# Altium schematic sheet total.SchDoc
size A3
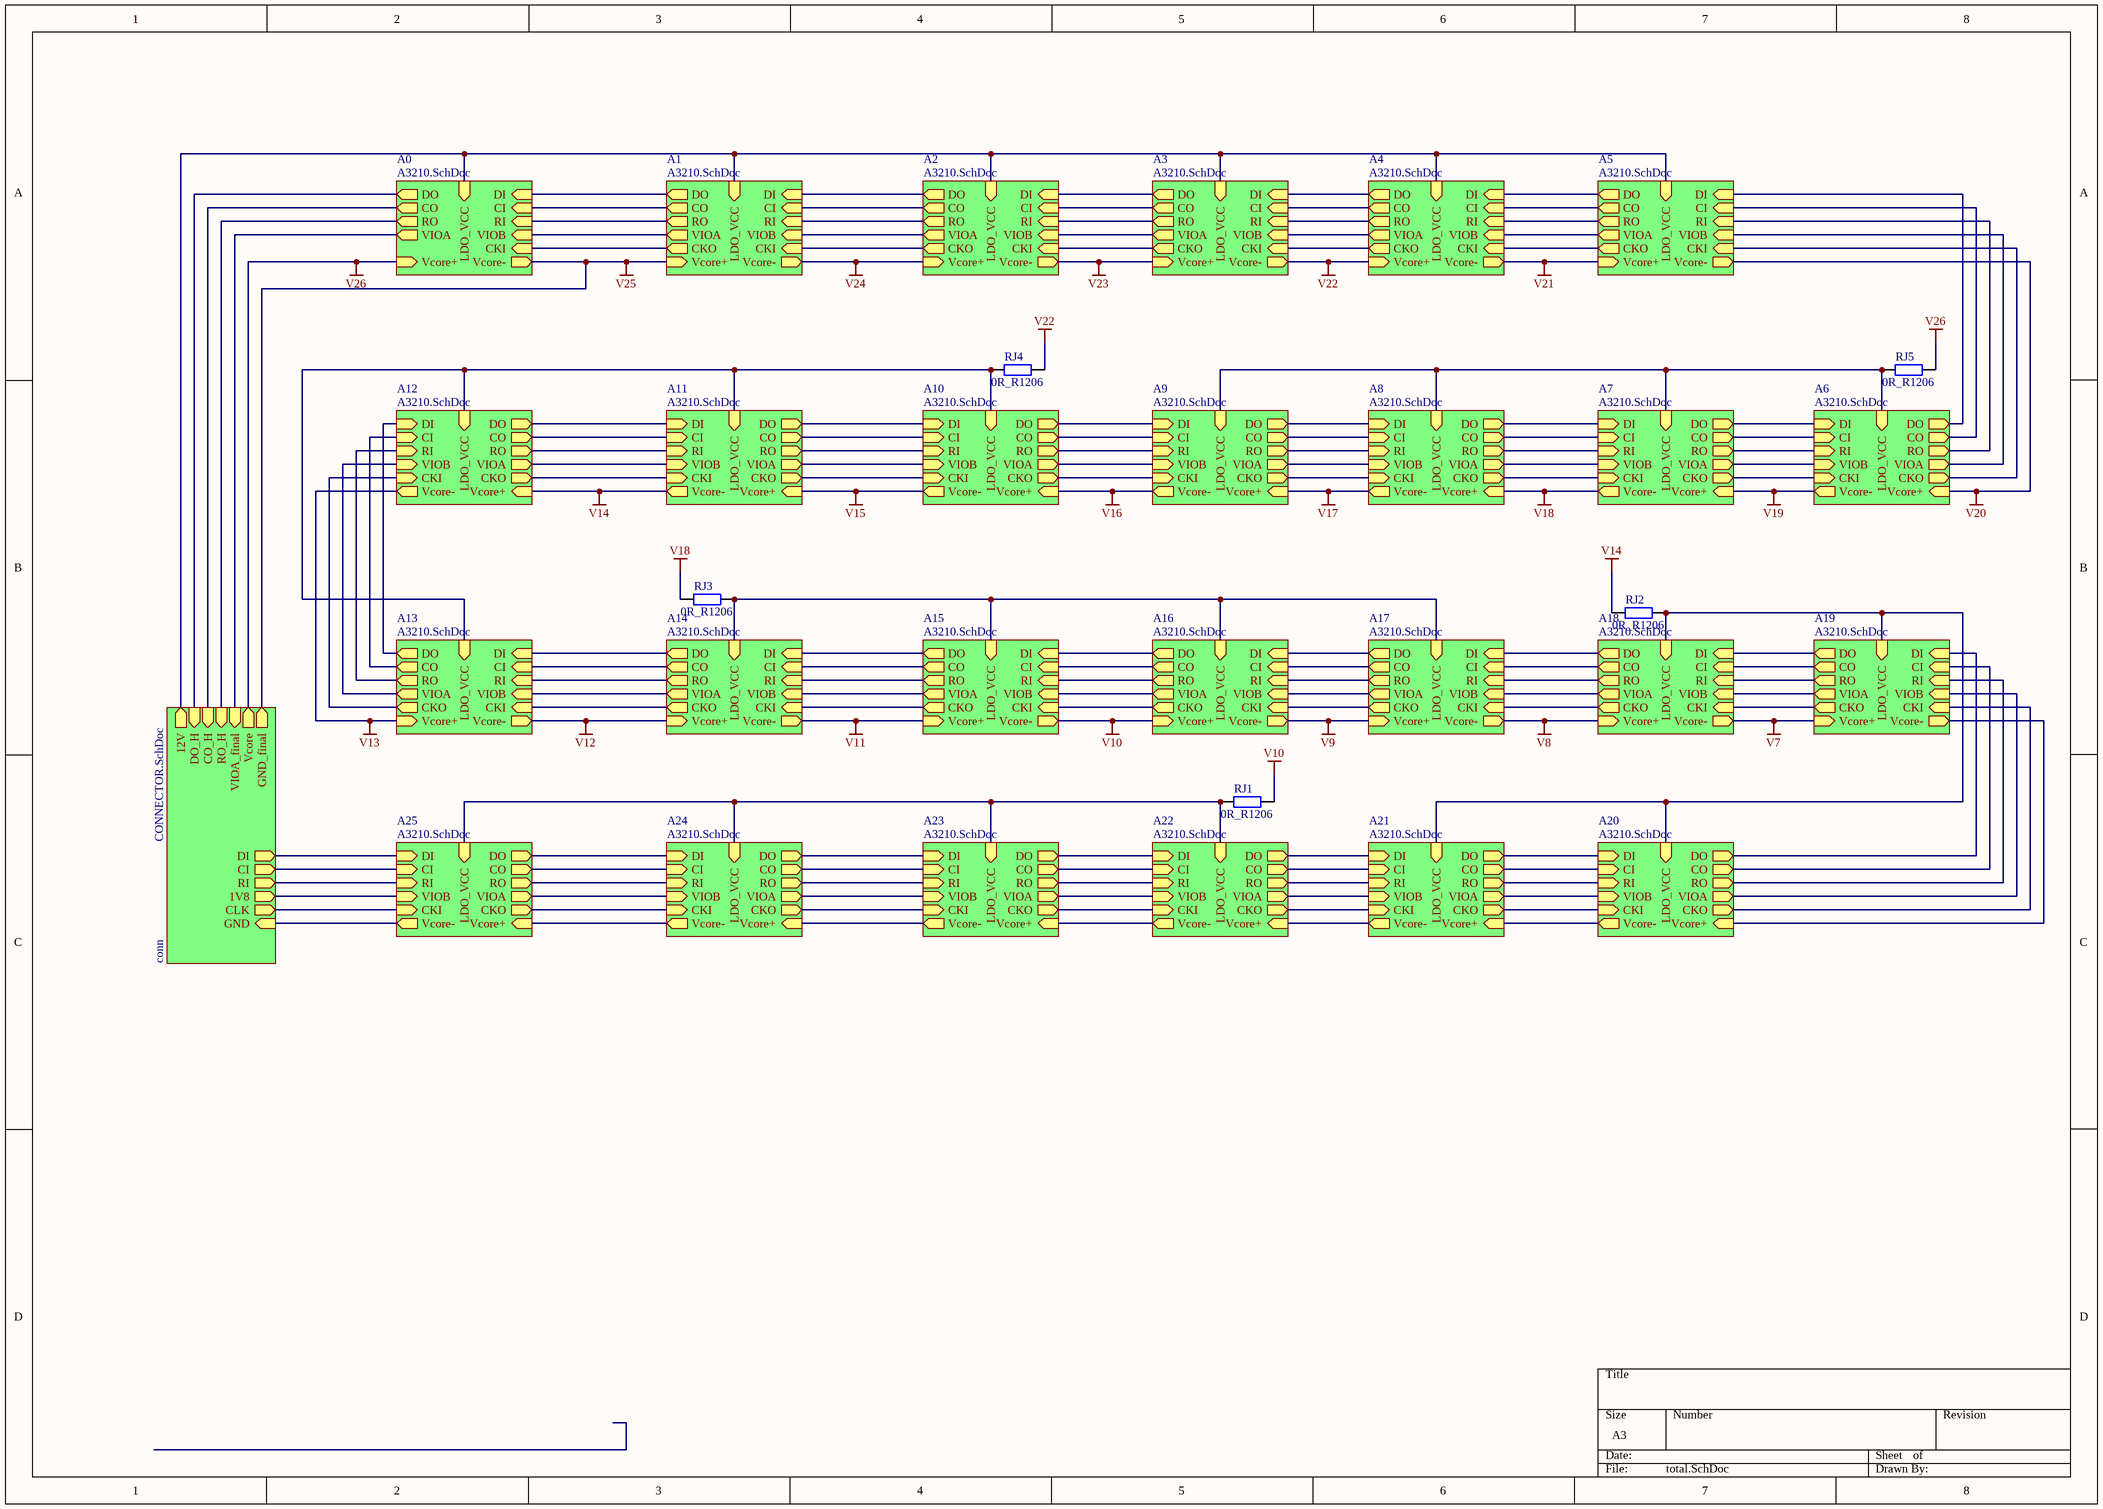
[diagram p0: total.SchDoc]

## Parts
RJ1  value 0R_R1206  [R1206]  (hidden comment: Res2)
RJ2  value 0R_R1206  [R1206]  (hidden comment: Res2)
RJ3  value 0R_R1206  [R1206]  (hidden comment: Res2)
RJ4  value 0R_R1206  [R1206]  (hidden comment: Res2)
RJ5  value 0R_R1206  [R1206]  (hidden comment: Res2)

## Sub-sheets
A0 = A3210.SchDoc: DI (in), CI (in), RI (in), DO (out), RO (out), CO (out), VIOB (in), VIOA (out), LDO_VCC (in), Vcore+ (in), Vcore- (out), CKI (in)
A1 = A3210.SchDoc: DI (in), CI (in), RI (in), DO (out), RO (out), CO (out), VIOB (in), VIOA (out), LDO_VCC (in), Vcore+ (in), Vcore- (out), CKI (in), CKO (out)
A2 = A3210.SchDoc: DI (in), CI (in), RI (in), DO (out), RO (out), CO (out), VIOB (in), VIOA (out), LDO_VCC (in), Vcore+ (in), Vcore- (out), CKI (in), CKO (out)
A3 = A3210.SchDoc: DI (in), CI (in), RI (in), DO (out), RO (out), CO (out), VIOB (in), VIOA (out), LDO_VCC (in), Vcore+ (in), Vcore- (out), CKI (in), CKO (out)
A4 = A3210.SchDoc: DI (in), CI (in), RI (in), DO (out), RO (out), CO (out), VIOB (in), VIOA (out), LDO_VCC (in), Vcore+ (in), Vcore- (out), CKI (in), CKO (out)
A5 = A3210.SchDoc: DI (in), CI (in), RI (in), DO (out), RO (out), CO (out), VIOB (in), VIOA (out), LDO_VCC (in), Vcore+ (in), Vcore- (out), CKI (in), CKO (out)
A6 = A3210.SchDoc: DI (in), CI (in), RI (in), DO (out), RO (out), CO (out), VIOB (in), VIOA (out), LDO_VCC (in), Vcore+ (in), Vcore- (out), CKI (in), CKO (out)
A7 = A3210.SchDoc: DI (in), CI (in), RI (in), DO (out), RO (out), CO (out), VIOB (in), VIOA (out), LDO_VCC (in), Vcore+ (in), Vcore- (out), CKI (in), CKO (out)
A8 = A3210.SchDoc: DI (in), CI (in), RI (in), DO (out), RO (out), CO (out), VIOB (in), VIOA (out), LDO_VCC (in), Vcore+ (in), Vcore- (out), CKI (in), CKO (out)
A9 = A3210.SchDoc: DI (in), CI (in), RI (in), DO (out), RO (out), CO (out), VIOB (in), VIOA (out), LDO_VCC (in), Vcore+ (in), Vcore- (out), CKI (in), CKO (out)
A10 = A3210.SchDoc: DI (in), CI (in), RI (in), DO (out), RO (out), CO (out), VIOB (in), VIOA (out), LDO_VCC (in), Vcore+ (in), Vcore- (out), CKI (in), CKO (out)
A11 = A3210.SchDoc: DI (in), CI (in), RI (in), DO (out), RO (out), CO (out), VIOB (in), VIOA (out), LDO_VCC (in), Vcore+ (in), Vcore- (out), CKI (in), CKO (out)
A12 = A3210.SchDoc: DI (in), CI (in), RI (in), DO (out), RO (out), CO (out), VIOB (in), VIOA (out), LDO_VCC (in), Vcore+ (in), Vcore- (out), CKI (in), CKO (out)
A13 = A3210.SchDoc: DI (in), CI (in), RI (in), DO (out), RO (out), CO (out), VIOB (in), VIOA (out), LDO_VCC (in), Vcore+ (in), Vcore- (out), CKI (in), CKO (out)
A14 = A3210.SchDoc: DI (in), CI (in), RI (in), DO (out), RO (out), CO (out), VIOB (in), VIOA (out), LDO_VCC (in), Vcore+ (in), Vcore- (out), CKI (in), CKO (out)
A15 = A3210.SchDoc: DI (in), CI (in), RI (in), DO (out), RO (out), CO (out), VIOB (in), VIOA (out), LDO_VCC (in), Vcore+ (in), Vcore- (out), CKI (in), CKO (out)
A16 = A3210.SchDoc: DI (in), CI (in), RI (in), DO (out), RO (out), CO (out), VIOB (in), VIOA (out), LDO_VCC (in), Vcore+ (in), Vcore- (out), CKI (in), CKO (out)
A17 = A3210.SchDoc: DI (in), CI (in), RI (in), DO (out), RO (out), CO (out), VIOB (in), VIOA (out), LDO_VCC (in), Vcore+ (in), Vcore- (out), CKI (in), CKO (out)
A18 = A3210.SchDoc: DI (in), CI (in), RI (in), DO (out), RO (out), CO (out), VIOB (in), VIOA (out), LDO_VCC (in), Vcore+ (in), Vcore- (out), CKI (in), CKO (out)
A19 = A3210.SchDoc: DI (in), CI (in), RI (in), DO (out), RO (out), CO (out), VIOB (in), VIOA (out), LDO_VCC (in), Vcore+ (in), Vcore- (out), CKI (in), CKO (out)
A20 = A3210.SchDoc: DI (in), CI (in), RI (in), DO (out), RO (out), CO (out), VIOB (in), VIOA (out), LDO_VCC (in), Vcore+ (in), Vcore- (out), CKI (in), CKO (out)
A21 = A3210.SchDoc: DI (in), CI (in), RI (in), DO (out), RO (out), CO (out), VIOB (in), VIOA (out), LDO_VCC (in), Vcore+ (in), Vcore- (out), CKI (in), CKO (out)
A22 = A3210.SchDoc: DI (in), CI (in), RI (in), DO (out), RO (out), CO (out), VIOB (in), VIOA (out), LDO_VCC (in), Vcore+ (in), Vcore- (out), CKI (in), CKO (out)
A23 = A3210.SchDoc: DI (in), CI (in), RI (in), DO (out), RO (out), CO (out), VIOB (in), VIOA (out), LDO_VCC (in), Vcore+ (in), Vcore- (out), CKI (in), CKO (out)
A24 = A3210.SchDoc: DI (in), CI (in), RI (in), DO (out), RO (out), CO (out), VIOB (in), VIOA (out), LDO_VCC (in), Vcore+ (in), Vcore- (out), CKI (in), CKO (out)
A25 = A3210.SchDoc: DI (in), CI (in), RI (in), DO (out), RO (out), CO (out), VIOB (in), VIOA (out), LDO_VCC (in), Vcore+ (in), Vcore- (out), CKI (in), CKO (out)
conn = CONNECTOR.SchDoc: RI (out), CI (out), DI (out), RO_H (in), CO_H (in), DO_H (in), 12V (out), 1V8 (out), GND (in), Vcore (out), CLK (out), VIOA_final (in), GND_final (out)

## Nets
V7: sheet A18/Vcore-, sheet A19/Vcore+
V8: sheet A18/Vcore+, sheet A17/Vcore-
V9: sheet A17/Vcore+, sheet A16/Vcore-
V10: RJ1.1 ; sheet A16/Vcore+, sheet A15/Vcore-
V11: sheet A15/Vcore+, sheet A14/Vcore-
V12: sheet A14/Vcore+, sheet A13/Vcore-
V13: sheet A13/Vcore+, sheet A12/Vcore-
V14: RJ2.2 ; sheet A11/Vcore-, sheet A12/Vcore+
V15: sheet A11/Vcore+, sheet A10/Vcore-
V16: sheet A10/Vcore+, sheet A9/Vcore-
V17: sheet A9/Vcore+, sheet A8/Vcore-
V18: RJ3.2 ; sheet A8/Vcore+, sheet A7/Vcore-
V19: sheet A7/Vcore+, sheet A6/Vcore-
V20: sheet A5/Vcore-, sheet A6/Vcore+
V21: sheet A5/Vcore+, sheet A4/Vcore-
V22: RJ4.1 ; sheet A4/Vcore+, sheet A3/Vcore-
V23: sheet A3/Vcore+, sheet A2/Vcore-
V24: sheet A2/Vcore+, sheet A1/Vcore-
V25: sheet conn/GND_final, sheet A0/Vcore-, sheet A1/Vcore+
V26: RJ5.1 ; sheet conn/Vcore, sheet A0/Vcore+
NetRJ1_2: RJ1.2 ; sheet A25/LDO_VCC, sheet A24/LDO_VCC, sheet A23/LDO_VCC, sheet A22/LDO_VCC
NetRJ2_1: RJ2.1 ; sheet A18/LDO_VCC, sheet A21/LDO_VCC, sheet A20/LDO_VCC, sheet A19/LDO_VCC
NetRJ3_1: RJ3.1 ; sheet A17/LDO_VCC, sheet A16/LDO_VCC, sheet A15/LDO_VCC, sheet A14/LDO_VCC
NetRJ4_2: RJ4.2 ; sheet A13/LDO_VCC, sheet A11/LDO_VCC, sheet A10/LDO_VCC, sheet A12/LDO_VCC
NetRJ5_2: RJ5.2 ; sheet A9/LDO_VCC, sheet A8/LDO_VCC, sheet A7/LDO_VCC, sheet A6/LDO_VCC
(unnamed): sheet A25/DI, sheet conn/DI
(unnamed): sheet A25/CI, sheet conn/CI
(unnamed): sheet A25/RI, sheet conn/RI
(unnamed): sheet A25/DO, sheet A24/DI
(unnamed): sheet A25/RO, sheet A24/RI
(unnamed): sheet A25/CO, sheet A24/CI
(unnamed): sheet A25/VIOB, sheet conn/1V8
(unnamed): sheet A25/VIOA, sheet A24/VIOB
(unnamed): sheet A25/Vcore+, sheet A24/Vcore-
(unnamed): sheet A25/Vcore-, sheet conn/GND
(unnamed): sheet A25/CKI, sheet conn/CLK
(unnamed): sheet A25/CKO, sheet A24/CKI
(unnamed): sheet conn/RO_H, sheet A0/RO
(unnamed): sheet conn/CO_H, sheet A0/CO
(unnamed): sheet conn/DO_H, sheet A0/DO
(unnamed): sheet conn/12V, sheet A0/LDO_VCC, sheet A5/LDO_VCC, sheet A4/LDO_VCC, sheet A3/LDO_VCC, sheet A2/LDO_VCC, sheet A1/LDO_VCC
(unnamed): sheet conn/VIOA_final, sheet A0/VIOA
(unnamed): sheet A0/DI, sheet A1/DO
(unnamed): sheet A0/CI, sheet A1/CO
(unnamed): sheet A0/RI, sheet A1/RO
(unnamed): sheet A0/VIOB, sheet A1/VIOA
(unnamed): sheet A0/CKI, sheet A1/CKO
(unnamed): sheet A18/DI, sheet A19/DO
(unnamed): sheet A18/CI, sheet A19/CO
(unnamed): sheet A18/RI, sheet A19/RO
(unnamed): sheet A18/DO, sheet A17/DI
(unnamed): sheet A18/RO, sheet A17/RI
(unnamed): sheet A18/CO, sheet A17/CI
(unnamed): sheet A18/VIOB, sheet A19/VIOA
(unnamed): sheet A18/VIOA, sheet A17/VIOB
(unnamed): sheet A18/CKI, sheet A19/CKO
(unnamed): sheet A18/CKO, sheet A17/CKI
(unnamed): sheet A24/DO, sheet A23/DI
(unnamed): sheet A24/RO, sheet A23/RI
(unnamed): sheet A24/CO, sheet A23/CI
(unnamed): sheet A24/VIOA, sheet A23/VIOB
(unnamed): sheet A24/Vcore+, sheet A23/Vcore-
(unnamed): sheet A24/CKO, sheet A23/CKI
(unnamed): sheet A23/DO, sheet A22/DI
(unnamed): sheet A23/RO, sheet A22/RI
(unnamed): sheet A23/CO, sheet A22/CI
(unnamed): sheet A23/VIOA, sheet A22/VIOB
(unnamed): sheet A23/Vcore+, sheet A22/Vcore-
(unnamed): sheet A23/CKO, sheet A22/CKI
(unnamed): sheet A22/DO, sheet A21/DI
(unnamed): sheet A22/RO, sheet A21/RI
(unnamed): sheet A22/CO, sheet A21/CI
(unnamed): sheet A22/VIOA, sheet A21/VIOB
(unnamed): sheet A22/Vcore+, sheet A21/Vcore-
(unnamed): sheet A22/CKO, sheet A21/CKI
(unnamed): sheet A21/DO, sheet A20/DI
(unnamed): sheet A21/RO, sheet A20/RI
(unnamed): sheet A21/CO, sheet A20/CI
(unnamed): sheet A21/VIOA, sheet A20/VIOB
(unnamed): sheet A21/Vcore+, sheet A20/Vcore-
(unnamed): sheet A21/CKO, sheet A20/CKI
(unnamed): sheet A20/DO, sheet A19/DI
(unnamed): sheet A20/RO, sheet A19/RI
(unnamed): sheet A20/CO, sheet A19/CI
(unnamed): sheet A20/VIOA, sheet A19/VIOB
(unnamed): sheet A20/Vcore+, sheet A19/Vcore-
(unnamed): sheet A20/CKO, sheet A19/CKI
(unnamed): sheet A17/DO, sheet A16/DI
(unnamed): sheet A17/RO, sheet A16/RI
(unnamed): sheet A17/CO, sheet A16/CI
(unnamed): sheet A17/VIOA, sheet A16/VIOB
(unnamed): sheet A17/CKO, sheet A16/CKI
(unnamed): sheet A16/DO, sheet A15/DI
(unnamed): sheet A16/RO, sheet A15/RI
(unnamed): sheet A16/CO, sheet A15/CI
(unnamed): sheet A16/VIOA, sheet A15/VIOB
(unnamed): sheet A16/CKO, sheet A15/CKI
(unnamed): sheet A15/DO, sheet A14/DI
(unnamed): sheet A15/RO, sheet A14/RI
(unnamed): sheet A15/CO, sheet A14/CI
(unnamed): sheet A15/VIOA, sheet A14/VIOB
(unnamed): sheet A15/CKO, sheet A14/CKI
(unnamed): sheet A14/DO, sheet A13/DI
(unnamed): sheet A14/RO, sheet A13/RI
(unnamed): sheet A14/CO, sheet A13/CI
(unnamed): sheet A14/VIOA, sheet A13/VIOB
(unnamed): sheet A14/CKO, sheet A13/CKI
(unnamed): sheet A13/DO, sheet A12/DI
(unnamed): sheet A13/RO, sheet A12/RI
(unnamed): sheet A13/CO, sheet A12/CI
(unnamed): sheet A13/VIOA, sheet A12/VIOB
(unnamed): sheet A13/CKO, sheet A12/CKI
(unnamed): sheet A5/DI, sheet A6/DO
(unnamed): sheet A5/CI, sheet A6/CO
(unnamed): sheet A5/RI, sheet A6/RO
(unnamed): sheet A5/DO, sheet A4/DI
(unnamed): sheet A5/RO, sheet A4/RI
(unnamed): sheet A5/CO, sheet A4/CI
(unnamed): sheet A5/VIOB, sheet A6/VIOA
(unnamed): sheet A5/VIOA, sheet A4/VIOB
(unnamed): sheet A5/CKI, sheet A6/CKO
(unnamed): sheet A5/CKO, sheet A4/CKI
(unnamed): sheet A4/DO, sheet A3/DI
(unnamed): sheet A4/RO, sheet A3/RI
(unnamed): sheet A4/CO, sheet A3/CI
(unnamed): sheet A4/VIOA, sheet A3/VIOB
(unnamed): sheet A4/CKO, sheet A3/CKI
(unnamed): sheet A3/DO, sheet A2/DI
(unnamed): sheet A3/RO, sheet A2/RI
(unnamed): sheet A3/CO, sheet A2/CI
(unnamed): sheet A3/VIOA, sheet A2/VIOB
(unnamed): sheet A3/CKO, sheet A2/CKI
(unnamed): sheet A2/DO, sheet A1/DI
(unnamed): sheet A2/RO, sheet A1/RI
(unnamed): sheet A2/CO, sheet A1/CI
(unnamed): sheet A2/VIOA, sheet A1/VIOB
(unnamed): sheet A2/CKO, sheet A1/CKI
(unnamed): sheet A11/DI, sheet A12/DO
(unnamed): sheet A11/CI, sheet A12/CO
(unnamed): sheet A11/RI, sheet A12/RO
(unnamed): sheet A11/DO, sheet A10/DI
(unnamed): sheet A11/RO, sheet A10/RI
(unnamed): sheet A11/CO, sheet A10/CI
(unnamed): sheet A11/VIOB, sheet A12/VIOA
(unnamed): sheet A11/VIOA, sheet A10/VIOB
(unnamed): sheet A11/CKI, sheet A12/CKO
(unnamed): sheet A11/CKO, sheet A10/CKI
(unnamed): sheet A10/DO, sheet A9/DI
(unnamed): sheet A10/RO, sheet A9/RI
(unnamed): sheet A10/CO, sheet A9/CI
(unnamed): sheet A10/VIOA, sheet A9/VIOB
(unnamed): sheet A10/CKO, sheet A9/CKI
(unnamed): sheet A9/DO, sheet A8/DI
(unnamed): sheet A9/RO, sheet A8/RI
(unnamed): sheet A9/CO, sheet A8/CI
(unnamed): sheet A9/VIOA, sheet A8/VIOB
(unnamed): sheet A9/CKO, sheet A8/CKI
(unnamed): sheet A8/DO, sheet A7/DI
(unnamed): sheet A8/RO, sheet A7/RI
(unnamed): sheet A8/CO, sheet A7/CI
(unnamed): sheet A8/VIOA, sheet A7/VIOB
(unnamed): sheet A8/CKO, sheet A7/CKI
(unnamed): sheet A7/DO, sheet A6/DI
(unnamed): sheet A7/RO, sheet A6/RI
(unnamed): sheet A7/CO, sheet A6/CI
(unnamed): sheet A7/VIOA, sheet A6/VIOB
(unnamed): sheet A7/CKO, sheet A6/CKI

## Library data of the parts
RJ1-RJ5 = Res2: Resistor; Published: 8-Jun-2000; LatestRevisionDate: 17-Jul-2002; LatestRevisionNote: Re-released for DXP Platform.; PackageReference: AXIAL-0.4; Publisher: Altium Limited